# Altium project Rocket_Engine_Igniter.PrjPcb
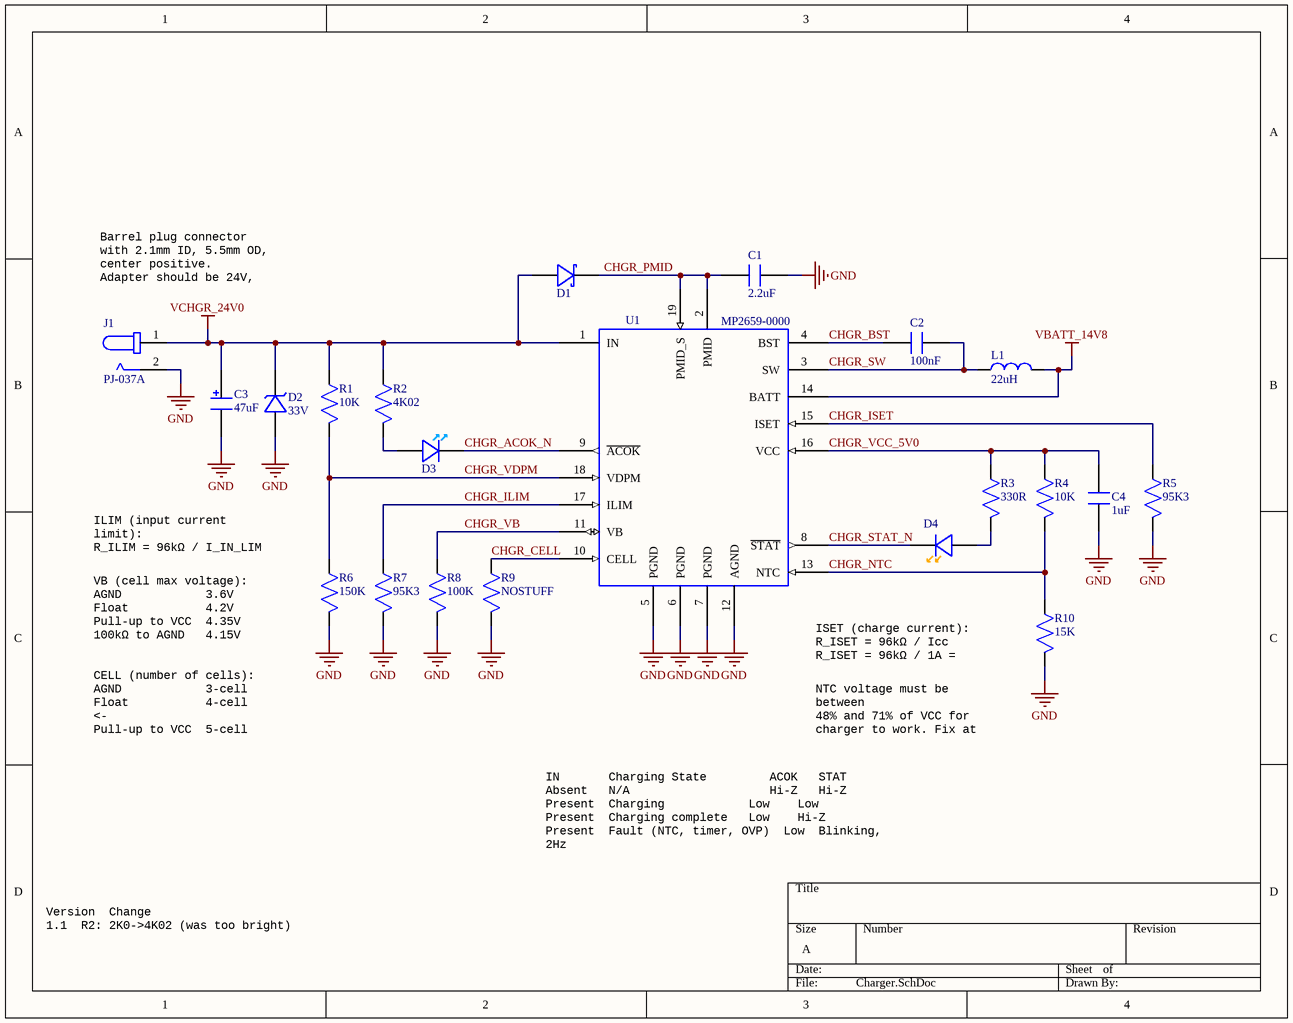
[diagram p0: Charger.SchDoc]
3 sheets, 68 parts. Net scope: global (net labels, ports and power ports of the same name join across sheets).
Board file: Rocket_Engine_Igniter.PcbDoc
Sheets:
  Charger.SchDoc
  Pulse_Generator.SchDoc
  Power.SchDoc

## Sheet Charger.SchDoc
size A

### Parts
C1  Capacitance: 2.2uF  [1206_CAP]
C2  Capacitance: 100nF  [0603_CAP]
C3  Capacitance: 47uF  [CAP_RADIAL_5MMx11MM]
C4  Capacitance: 1uF  [0603_CAP]
D1  *  [DO-214AC_SMA]  (value not drawn)
D2  Reverse Standoff Voltage: 33V  [DO-214AC_SMA]  (hidden comment: *)
D3  *  [LED_1411]  (value not drawn)
D4  *  [LED_1411]  (value not drawn)
J1  Part Number: PJ-037A  [CONN_BARREL_PLUG_PJ-037A]  (hidden comment: *)
L1  Inductance: 22uH  [IND_AMRM00101040220MA1]
R1  Resistance: 10K  [0603_RES]
R2  Resistance: 4K02  [0603_RES]
R3  Resistance: 330R  [0603_RES]
R4  Resistance: 10K  [0603_RES]
R5  Resistance: 95K3  [0603_RES]
R6  Resistance: 150K  [0603_RES]
R7  Resistance: 95K3  [0603_RES]
R8  Resistance: 100K  [0603_RES]
R9  (no value)  [0603_RES]
R10  Resistance: 15K  [0603_RES]
U1  Part Number: MP2659-0000  [QFN-19]

### Nets
GND: C1.1 C3.2 C4.1 D2.2 J1.2 R5.1 R6.1 R7.1 R8.1 R9.1 R10.1 U1.5(PGND) U1.6(PGND) U1.7(PGND) U1.12(AGND)
VBATT_14V8: L1.2 U1.14(BATT)
VCHGR_24V0: C3.1 D1.2 D2.1 J1.1 R1.2 R2.2 U1.1(IN)
CHGR_ACOK_N: D3.1 U1.9(~{ACOK})
CHGR_BST: C2.2 U1.4(BST)
CHGR_CELL: R9.2 U1.10(CELL)
CHGR_ILIM: R7.2 U1.17(ILIM)
CHGR_ISET: R5.2 U1.15(ISET)
CHGR_NTC: R4.1 R10.2 U1.13(NTC)
CHGR_PMID: C1.2 D1.1 U1.2(PMID) U1.19(PMID_S)
CHGR_STAT_N: D4.1 U1.8(~{STAT})
CHGR_SW: C2.1 L1.1 U1.3(SW)
CHGR_VB: R8.2 U1.11(VB)
CHGR_VCC_5V0: C4.2 R3.2 R4.2 U1.16(VCC)
CHGR_VDPM: R1.1 R6.2 U1.18(VDPM)
NetD3_2: D3.2 R2.1
NetD4_2: D4.2 R3.1

### Notes on the sheet
- Barrel plug connector with 2.1mm ID, 5.5mm OD, center positive.
  Adapter should be 24V, 1A+.
- ILIM (input current limit):
  R_ILIM = 96kΩ / I_IN_LIM
  R_ILIM = 96kΩ / 1A = 96kΩ
- VB (cell max voltage):
  AGND            3.6V
  Float           4.2V
  Pull-up to VCC  4.35V
  100kΩ to AGND   4.15V <-
- ISET (charge current):
  R_ISET = 96kΩ / Icc
  R_ISET = 96kΩ / 1A = 96kΩ
- CELL (number of cells):
  AGND            3-cell
  Float           4-cell <-
  Pull-up to VCC  5-cell
  100kΩ to AGND   6-cell
- (near R10) NTC voltage must be between
  48% and 71% of VCC for
  charger to work. Fix at 60%
  with 10kΩ/15kΩ divider.
- IN       Charging State      	  ACOK   STAT
  Absent   N/A                 	  Hi-Z   Hi-Z
  Present  Charging         	  Low    Low
  Present  Charging complete	  Low    Hi-Z
  Present  Fault (NTC, timer, OVP)  Low	 Blinking, 2Hz
  Present  Regulation mode          Low    Blinking, 1Hz
- Version		Change
  1.1		R2: 2K0->4K02 (was too bright)

### Library data of the parts
C1 = CAP_1206_2.2uF: Manufacturer: Samsung Electro-Mechanics; Part Number: CL31B225KBHNFNE; Tolerance: 10%; Voltage: 50V; Dielectric: X7R; Case: 1206
C2 = CAP_0603_100nF: Manufacturer: Samsung Electro-Mechanics; Part Number: CL10B104KB8NNWC; Tolerance: 10%; Voltage: 50V; Dielectric: X7R
C3 = CAP_RADIAL_47uF: Manufacturer: Würth Elektronik; Part Number: 860020572006; Tolerance: 20%; Voltage: 35V; Case: Radial, Can
C4 = CAP_0603_1uF: Manufacturer: Samsung Electro-Mechanics; Part Number: CL10B105KA8NNNC; Tolerance: 10%; Voltage: 25V; Dielectric: X7R
D1 = DIODE_SCHOTTKY_40V_2A: Manufacturer: Diodes Incorporated; Part Number: B240AE-13; Max Reverse Voltage: 40V; Average Forward Current: 2A; Package: DO-214AC_SMA
D2 = DIODE_TVS_33V_UNIDIR: Manufacturer: Diodes Incorporated; Part Number: SMAJ33AQ-13-F; Package: DO-214AC_SMA
D3 = LED_BLUE_150141BS73100: Manufacturer: Würth Elektronik; Part Number: 150141BS73100; Package: SMD 1411
D4 = LED_AMBER_150141AS73100: Manufacturer: Würth Elektronik; Part Number: 150141AS73100; Package: SMD 1411
J1 = CONN_BARREL_PLUG_PJ-037A: Manufacturer: CUI Devices; Mating Diameter: 2.1mm ID, 5.5mm OD; Max Current: 2.5A; Rated Voltage: 24V
L1 = IND_AMRM00101040220MA1_22U0: Manufacturer: Pulse Electronics; DCR: 0.066Ohm; Saturation Current: 5A; Tolerance: 20%; Part Number: AMRM00101040220MA1
R1 R4 = RES_0603_10K: Manufacturer: Stackpole Electronics Inc; Part Number: RMCF0603FT10K0; Tolerance: 1%; Temperature Coefficient: 100ppm; Power Rating: 0.1W
R2 = RES_0603_4K02: Manufacturer: Stackpole Electronics Inc; Part Number: RMCF0603FT4K02; Tolerance: 1%; Temperature Coefficient: 100ppm; Power Rating: 0.1W
R3 = RES_0603_330R: Manufacturer: Stackpole Electronics Inc; Part Number: RMCF0603FT330R; Tolerance: 1%; Temperature Coefficient: 100ppm; Power Rating: 0.1W
R5 R7 = RES_0603_95K3: Manufacturer: Stackpole Electronics Inc.; Part Number: RMCF0603FT95K3; Tolerance: 1%; Power Rating: 0.1W; Temperature Coefficient: 100ppm
R6 = RES_0603_150K: Manufacturer: Stackpole Electronics Inc; Part Number: RMCF0603FG150K; Tolerance: 1%; Temperature Coefficient: 100ppm; Power Rating: 0.1W
R8 = RES_0603_100K: Manufacturer: Stackpole; Part Number: RMCF0603FT100K; Tolerance: 1%; Temperature Coefficient: 100ppm; Power Rating: 0.1W
R9 = RES_0603_NOSTUFF: Manufacturer: *; Part Number: *; Resistance: *; Tolerance: *; NOSTUFF: NOSTUFF
R10 = RES_0603_15K: Manufacturer: Stackpole Electronics Inc; Part Number: RMCF0603FG15K0; Tolerance: 1%; Power Rating: 0.1W; Temperature Coefficient: 100ppm
U1 = MP2659: Manufacturer: Monolithic Power Systems; Package: QFN-19

## Sheet Pulse_Generator.SchDoc
size A
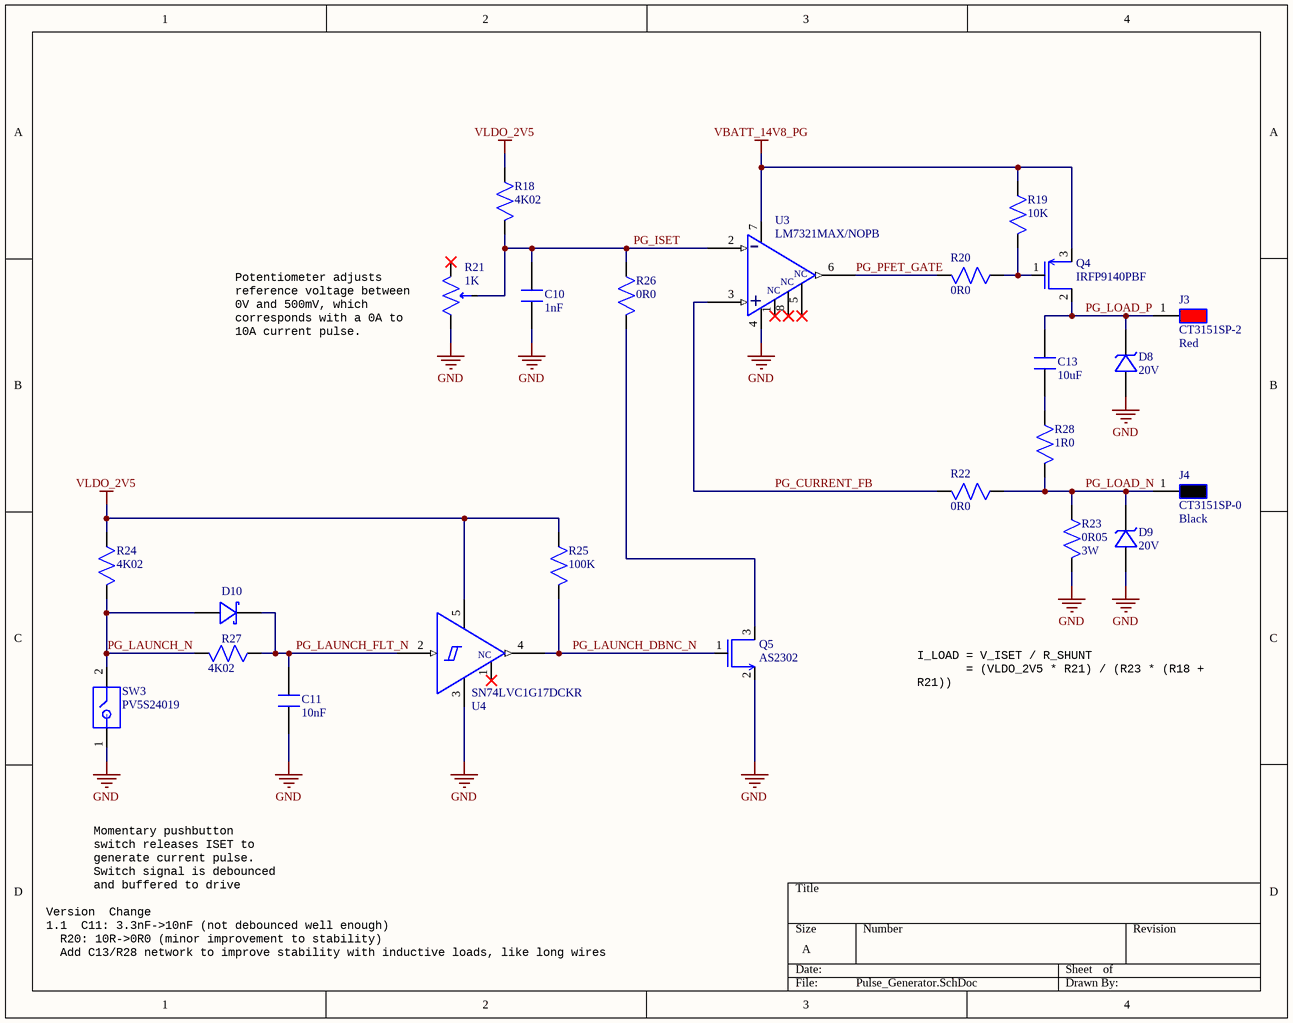
[diagram p1: Pulse_Generator.SchDoc]

### Parts
C10  Capacitance: 1nF  [0603_CAP]
C11  Capacitance: 10nF  [0603_CAP]  (hidden comment: CAP_0603_10nF)
C13  Capacitance: 10uF  [0805_CAP]  (hidden comment: CAP_0805_10uF)
D8  Reverse Standoff Voltage: 20V  [DO-214AC_SMA]  (hidden comment: *)
D9  Reverse Standoff Voltage: 20V  [DO-214AC_SMA]  (hidden comment: *)
D10  *  [SOD-523]  (value not drawn)
J3  Part Number: CT3151SP-2  Colour: Red  [CONN_BANANA_RED_CT3151SP-2]  (hidden comment: *)
J4  Part Number: CT3151SP-0  Colour: Black  [CONN_BANANA_BLK_CT3151SP-0]  (hidden comment: *)
Q4  Part Number: IRFP9140PBF  [TO-247AC_NOHOLE]  (hidden comment: *)
Q5  Part Number: AS2302  [SOT-23-3]  (hidden comment: *)
R18  Resistance: 4K02  [0603_RES]
R19  Resistance: 10K  [0603_RES]
R20  Resistance: 0R0  [0603_RES]
R21  Resistance: 1K  [POT_PTV09A-4x15F-xxxx]
R22  Resistance: 0R0  [0603_RES]
R23  Resistance: 0R05  Power Rating: 3W  [RES_BR3FB50L0_0R05_1%]
R24  Resistance: 4K02  [0603_RES]
R25  Resistance: 100K  [0603_RES]
R26  Resistance: 0R0  [0603_RES]
R27  Resistance: 4K02  [0603_RES]
R28  Resistance: 1R0  [0805_RES]  (hidden comment: RES_0805_1R0)
SW3  Part Number: PV5S24019  [SW_PUSHBUTTON_PV5S24019]  (hidden comment: *)
U3  Part Number: LM7321MAX/NOPB  [SOIC-8_TI_PACKAGE_D]  (hidden comment: *)
U4  Part Number: SN74LVC1G17DCKR  [SOT-353]  (hidden comment: *)

### Nets
GND: C10.1 C11.1 D8.2 D9.2 Q5.2(S) R21.1 R23.1 SW3.1 U3.4(V-) U4.3(GND)
VBATT_14V8_PG: Q4.3(S) R19.2 U3.7(V+)
VLDO_2V5: R18.2 R24.2 R25.2 U4.5(VCC)
PG_CURRENT_FB: R22.1 U3.3(IN+)
PG_ISET: C10.2 R18.1 R21.2 R26.2 U3.2(IN-)
PG_LAUNCH_DBNC_N: Q5.1(G) R25.1 U4.4(Y)
PG_LAUNCH_FLT_N: C11.2 D10.1 R27.2 U4.2(A)
PG_LAUNCH_N: D10.2 R24.1 R27.1 SW3.2
PG_LOAD_N: D9.1 J4.1 R22.2 R23.2 R28.1
PG_LOAD_P: C13.2 D8.1 J3.1 Q4.2(D)
PG_PFET_GATE: R20.1 U3.6(OUT)
NetC13_1: C13.1 R28.2
NetQ4_1: Q4.1(G) R19.1 R20.2
NetQ5_3: Q5.3(D) R26.1

Not connected (* = marked no-connect by the designer): R21 3*; U3 1(NC)* 5(NC)* 8(NC)*; U4 1(NC)*

### Notes on the sheet
- (near R21) Potentiometer adjusts reference voltage between 0V and 500mV, which corresponds with a 0A to 10A current pulse.
- I_LOAD = V_ISET / R_SHUNT
  = (VLDO_2V5 * R21) / (R23 * (R18 + R21))
  = (2.5 * R21) / (0.05 * (4020 + R21))
- Momentary pushbutton switch releases ISET to generate current pulse. Switch signal is debounced and buffered to drive NFET.
- Version		Change
  1.1		C11: 3.3nF->10nF (not debounced well enough)
  R20: 10R->0R0 (minor improvement to stability)
  Add C13/R28 network to improve stability with inductive loads, like long wires
- (in symbol LM7321) -; +

### Library data of the parts
C10 = CAP_0603_1nF: Manufacturer: KYOCERA AVX; Part Number: KGM15AR71H102KT; Tolerance: 10%; Voltage: 50V; Dielectric: X7R
C11 = CAP_0603_10nF: Manufacturer: Samsung Electro-Mechanics; Part Number: CL10B103KB8NNNC; Tolerance: 10%; Voltage: 50V; Dielectric: X7R
C13 = CAP_0805_10uF: Manufacturer: Yageo; Part Number: CC0805KKX5R5BB106; Tolerance: 10%; Voltage: 6.3V
D8 D9 = DIODE_TVS_20V_UNIDIR: Manufacturer: Diodes Incorporated; Part Number: SMAJ20AQ-13-F; Package: DO-214AC_SMA
D10 = DIODE_RB520S30T5G: Manufacturer: ON Semiconductor; Max Reverse Voltage: 30V; Part Number: RB520S30T5G; Package: SOD-523
J3 = CONN_BANANA_RED_CT3151SP-2: Manufacturer: Cal Test Electronics
J4 = CONN_BANANA_BLK_CT3151SP-2_1: Manufacturer: Cal Test Electronics
Q4 = PFET_IRFP9140: Manufacturer: Vishay; Package: TO-247-3
Q5 = NFET_AS2302: Manufacturer: ANBON SEMICONDUCTOR (INT'L) LIMITED; Package: SOT-23-3
R18 R24 R27 = RES_0603_4K02: as R2 on sheet Charger
R19 = RES_0603_10K: as R1 on sheet Charger
R20 R22 R26 = RES_0603_0R0
R21 = POT_1K_PTV09A-4015F-B102: Manufacturer: Bourns Inc.; Tolerance: 20%; Power Rating: 0.05W; Part Number: PTV09A-4015F-B102
R23 = RES_BR3FB50L0_0R05_1%: Manufacturer: Stackpole Electronics; Tolerance: 1%; Part Number: BR3FB50L0
R25 = RES_0603_100K: as R8 on sheet Charger
R28 = RES_0805_1R0: Manufacturer: Stackpole Electronics Inc; Part Number: RMCF0805FT1R00; Tolerance: 1%; Temperature Coefficient: 200ppm; Power Rating: 0.125W
SW3 = SW_PUSHBUTTON_PV5S24019: Manufacturer: E-Switch
U3 = LM7321: Manufacturer: Texas Instruments; Package: SOIC-8
U4 = SN74LVC1G17: Manufacturer: Texas Instruments; Package: SOT-353

## Sheet Power.SchDoc
size A
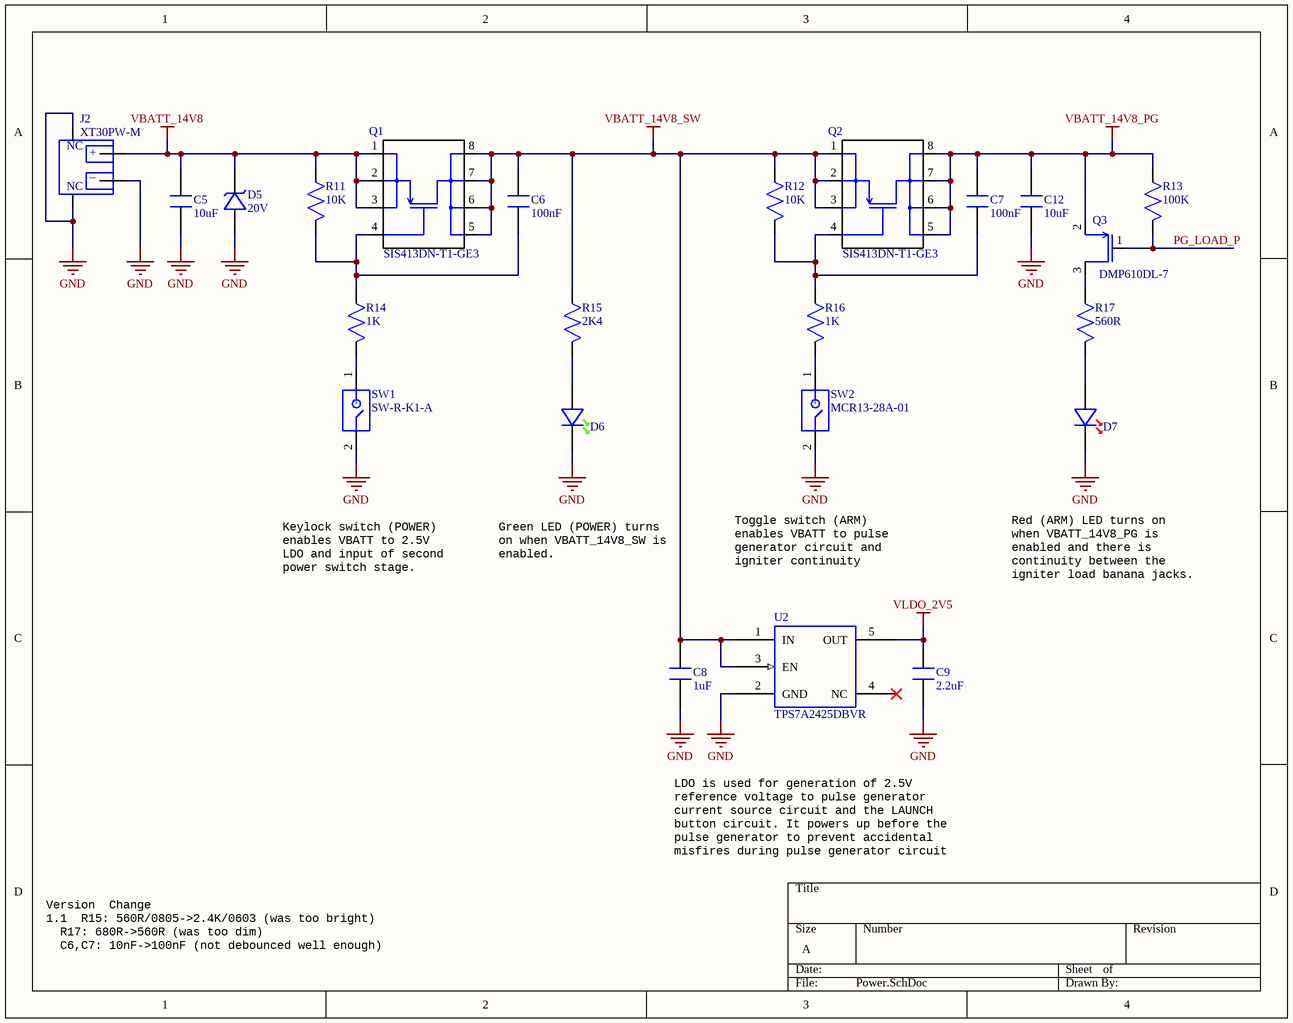
[diagram p2: Power.SchDoc]

### Parts
C5  Capacitance: 10uF  [1206_CAP]
C6  Capacitance: 100nF  [0603_CAP]  (hidden comment: CAP_0603_100nF)
C7  Capacitance: 100nF  [0603_CAP]  (hidden comment: CAP_0603_100nF)
C8  Capacitance: 1uF  [0603_CAP]
C9  Capacitance: 2.2uF  [0603_CAP]
C12  Capacitance: 10uF  [1206_CAP]
D5  Reverse Standoff Voltage: 20V  [DO-214AC_SMA]  (hidden comment: *)
D6  *  [LED_1411]  (value not drawn)
D7  *  [LED_1411]  (value not drawn)
J2  Part Number: XT30PW-M  [CONN_PLUG_XT30PW-M]
Q1  Part Number: SIS413DN-T1-GE3  [PFET_POWERPAK_1212-8]  (hidden comment: *)
Q2  Part Number: SIS413DN-T1-GE3  [PFET_POWERPAK_1212-8]  (hidden comment: *)
Q3  Part Number: DMP610DL-7  [SOT-23-3]  (hidden comment: *)
R11  Resistance: 10K  [0603_RES]
R12  Resistance: 10K  [0603_RES]
R13  Resistance: 100K  [0603_RES]
R14  Resistance: 1K  [0603_RES]
R15  Resistance: 2K4  [0603_RES]  (hidden comment: RES_0603_2K4)
R16  Resistance: 1K  [0603_RES]
R17  Resistance: 560R  [0805_RES]  (hidden comment: RES_0805_560R)
SW1  Part Number: SW-R-K1-A  [SW_KEYLOCK_SW-R-K1-A]  (hidden comment: *)
SW2  Part Number: MCR13-28A-01  [SW_TOGGLE_MCR13-28A-01]  (hidden comment: *)
U2  TPS7A2425DBVR  [SOT-23-5]

### Nets
GND: C5.1 C8.1 C9.1 C12.1 D5.2 D6.1 D7.1 J2.2 SW1.2 SW2.2 U2.2(GND)
VBATT_14V8: C5.2 D5.1 J2.1 Q1.1(S) Q1.2(S) Q1.3(S) R11.2
VBATT_14V8_PG: C7.2 C12.2 Q2.5(D) Q2.6(D) Q2.7(D) Q2.8(D) Q3.2(S) R13.2
VBATT_14V8_SW: C6.2 C8.2 Q1.5(D) Q1.6(D) Q1.7(D) Q1.8(D) Q2.1(S) Q2.2(S) Q2.3(S) R12.2 R15.2 U2.1(IN) U2.3(EN)
VLDO_2V5: C9.2 U2.5(OUT)
PG_LOAD_P: Q3.1(G) R13.1
NetC6_1: C6.1 Q1.4(G) R11.1 R14.2
NetC7_1: C7.1 Q2.4(G) R12.1 R16.2
NetD6_2: D6.2 R15.1
NetD7_2: D7.2 R17.1
NetQ3_3: Q3.3(D) R17.2
NetR14_1: R14.1 SW1.1
NetR16_1: R16.1 SW2.1

Not connected (* = marked no-connect by the designer): U2 4(NC)*

### Notes on the sheet
- Keylock switch (POWER) enables VBATT to 2.5V LDO and input of second power switch stage.
- Green LED (POWER) turns on when VBATT_14V8_SW is enabled.
- Toggle switch (ARM) enables VBATT to pulse generator circuit and igniter continuity checker.
- Red (ARM) LED turns on when VBATT_14V8_PG is enabled and there is continuity between the igniter load banana jacks.
- LDO is used for generation of 2.5V reference voltage to pulse generator current source circuit and the LAUNCH button circuit. It powers up before the pulse generator to prevent accidental misfires during pulse generator circuit startup.
- Version		Change
  1.1		R15: 560R/0805->2.4K/0603 (was too bright)
  R17: 680R->560R (was too dim)
  C6,C7: 10nF->100nF (not debounced well enough)
- (in symbol CONN_PLUG_XT30PW-M) NC; +; _

### Library data of the parts
C5 C12 = CAP_1206_10uF: Manufacturer: Samsung Electro-Mechanics; Part Number: CL31A106MBHNNNE; Tolerance: 20%; Voltage: 50V; Dielectric: X5R
C6 C7 = CAP_0603_100nF: as C2 on sheet Charger
C8 = CAP_0603_1uF: as C4 on sheet Charger
C9 = CAP_0603_2.2uF: Manufacturer: Samsung Electro-Mechanics; Part Number: CL10B225KP8NNNC; Tolerance: 10%; Voltage: 10V; Dielectric: X7R
D5 = DIODE_TVS_20V_UNIDIR: as D8 on sheet Pulse_Generator; Package: DO-214AC_SMA
D6 = LED_GREEN_150141GS73100: Manufacturer: Würth Elektronik; Part Number: 150141GS73100; Package: SMD 1411
D7 = LED_RED_150141RS73100: Manufacturer: Würth Elektronik; Part Number: 150141RS73100; Package: SMD 1411
J2 = CONN_PLUG_XT30PW-M: Manufacturer: AMASS
Q1 Q2 = PFET_SIS413DN: Manufacturer: Vishay Siliconix; Package: PowerPAK® 1212-8
Q3 = PFET_DMP610DL: Manufacturer: Diodes Incorporated; Package: SOT-23-3
R11 R12 = RES_0603_10K: as R1 on sheet Charger
R13 = RES_0603_100K: as R8 on sheet Charger
R14 R16 = RES_0603_1K: Manufacturer: Stackpole Electronics Inc; Part Number: RMCF0603FT1K00; Temperature Coefficient: 100ppm; Tolerance: 1%; Power Rating: 0.1W
R15 = RES_0603_2K4: Manufacturer: Stackpole Electronics Inc; Part Number: RMCF0603FT2K40; Tolerance: 1%; Power Rating: 0.1W; Temperature Coefficient: 100ppm
R17 = RES_0805_560R: Manufacturer: Vishay Dale; Part Number: CRCW0805560RFKEAHP; Tolerance: 1%; Power Rating: 0.5W; Temperature Coefficient: 100ppm
SW1 = SW_KEYLOCK_SW-R-K1-A: Manufacturer: Adam Tech
SW2 = SW_TOGGLE_MCR13-28A-01: Manufacturer: Multicomp
U2 = TPS7A2425DBVR: Manufacturer: Texas Instruments; Package: SOT-23-5; Part Number: TPS7A2425DBVR

## Nets that join several sheets
GND: Charger (15 pins), Pulse_Generator (10 pins), Power (11 pins)
VBATT_14V8: Charger (L1.2 U1.14), Power (7 pins)
VBATT_14V8_PG: Pulse_Generator (Q4.3 R19.2 U3.7), Power (8 pins)
VLDO_2V5: Pulse_Generator (R18.2 R24.2 R25.2 U4.5), Power (C9.2 U2.5)
PG_LOAD_P: Pulse_Generator (C13.2 D8.1 J3.1 Q4.2), Power (Q3.1 R13.1)